# EasyEDA schematic SCH_Sensor Universal PCB w XOR_2023-07-05.json
TITLE: Sheet_1; REV: 1.0; Date: 2022-06-12; Sheet: 1/1; Drawn By: Edward Niedziejko; Company: Your Company
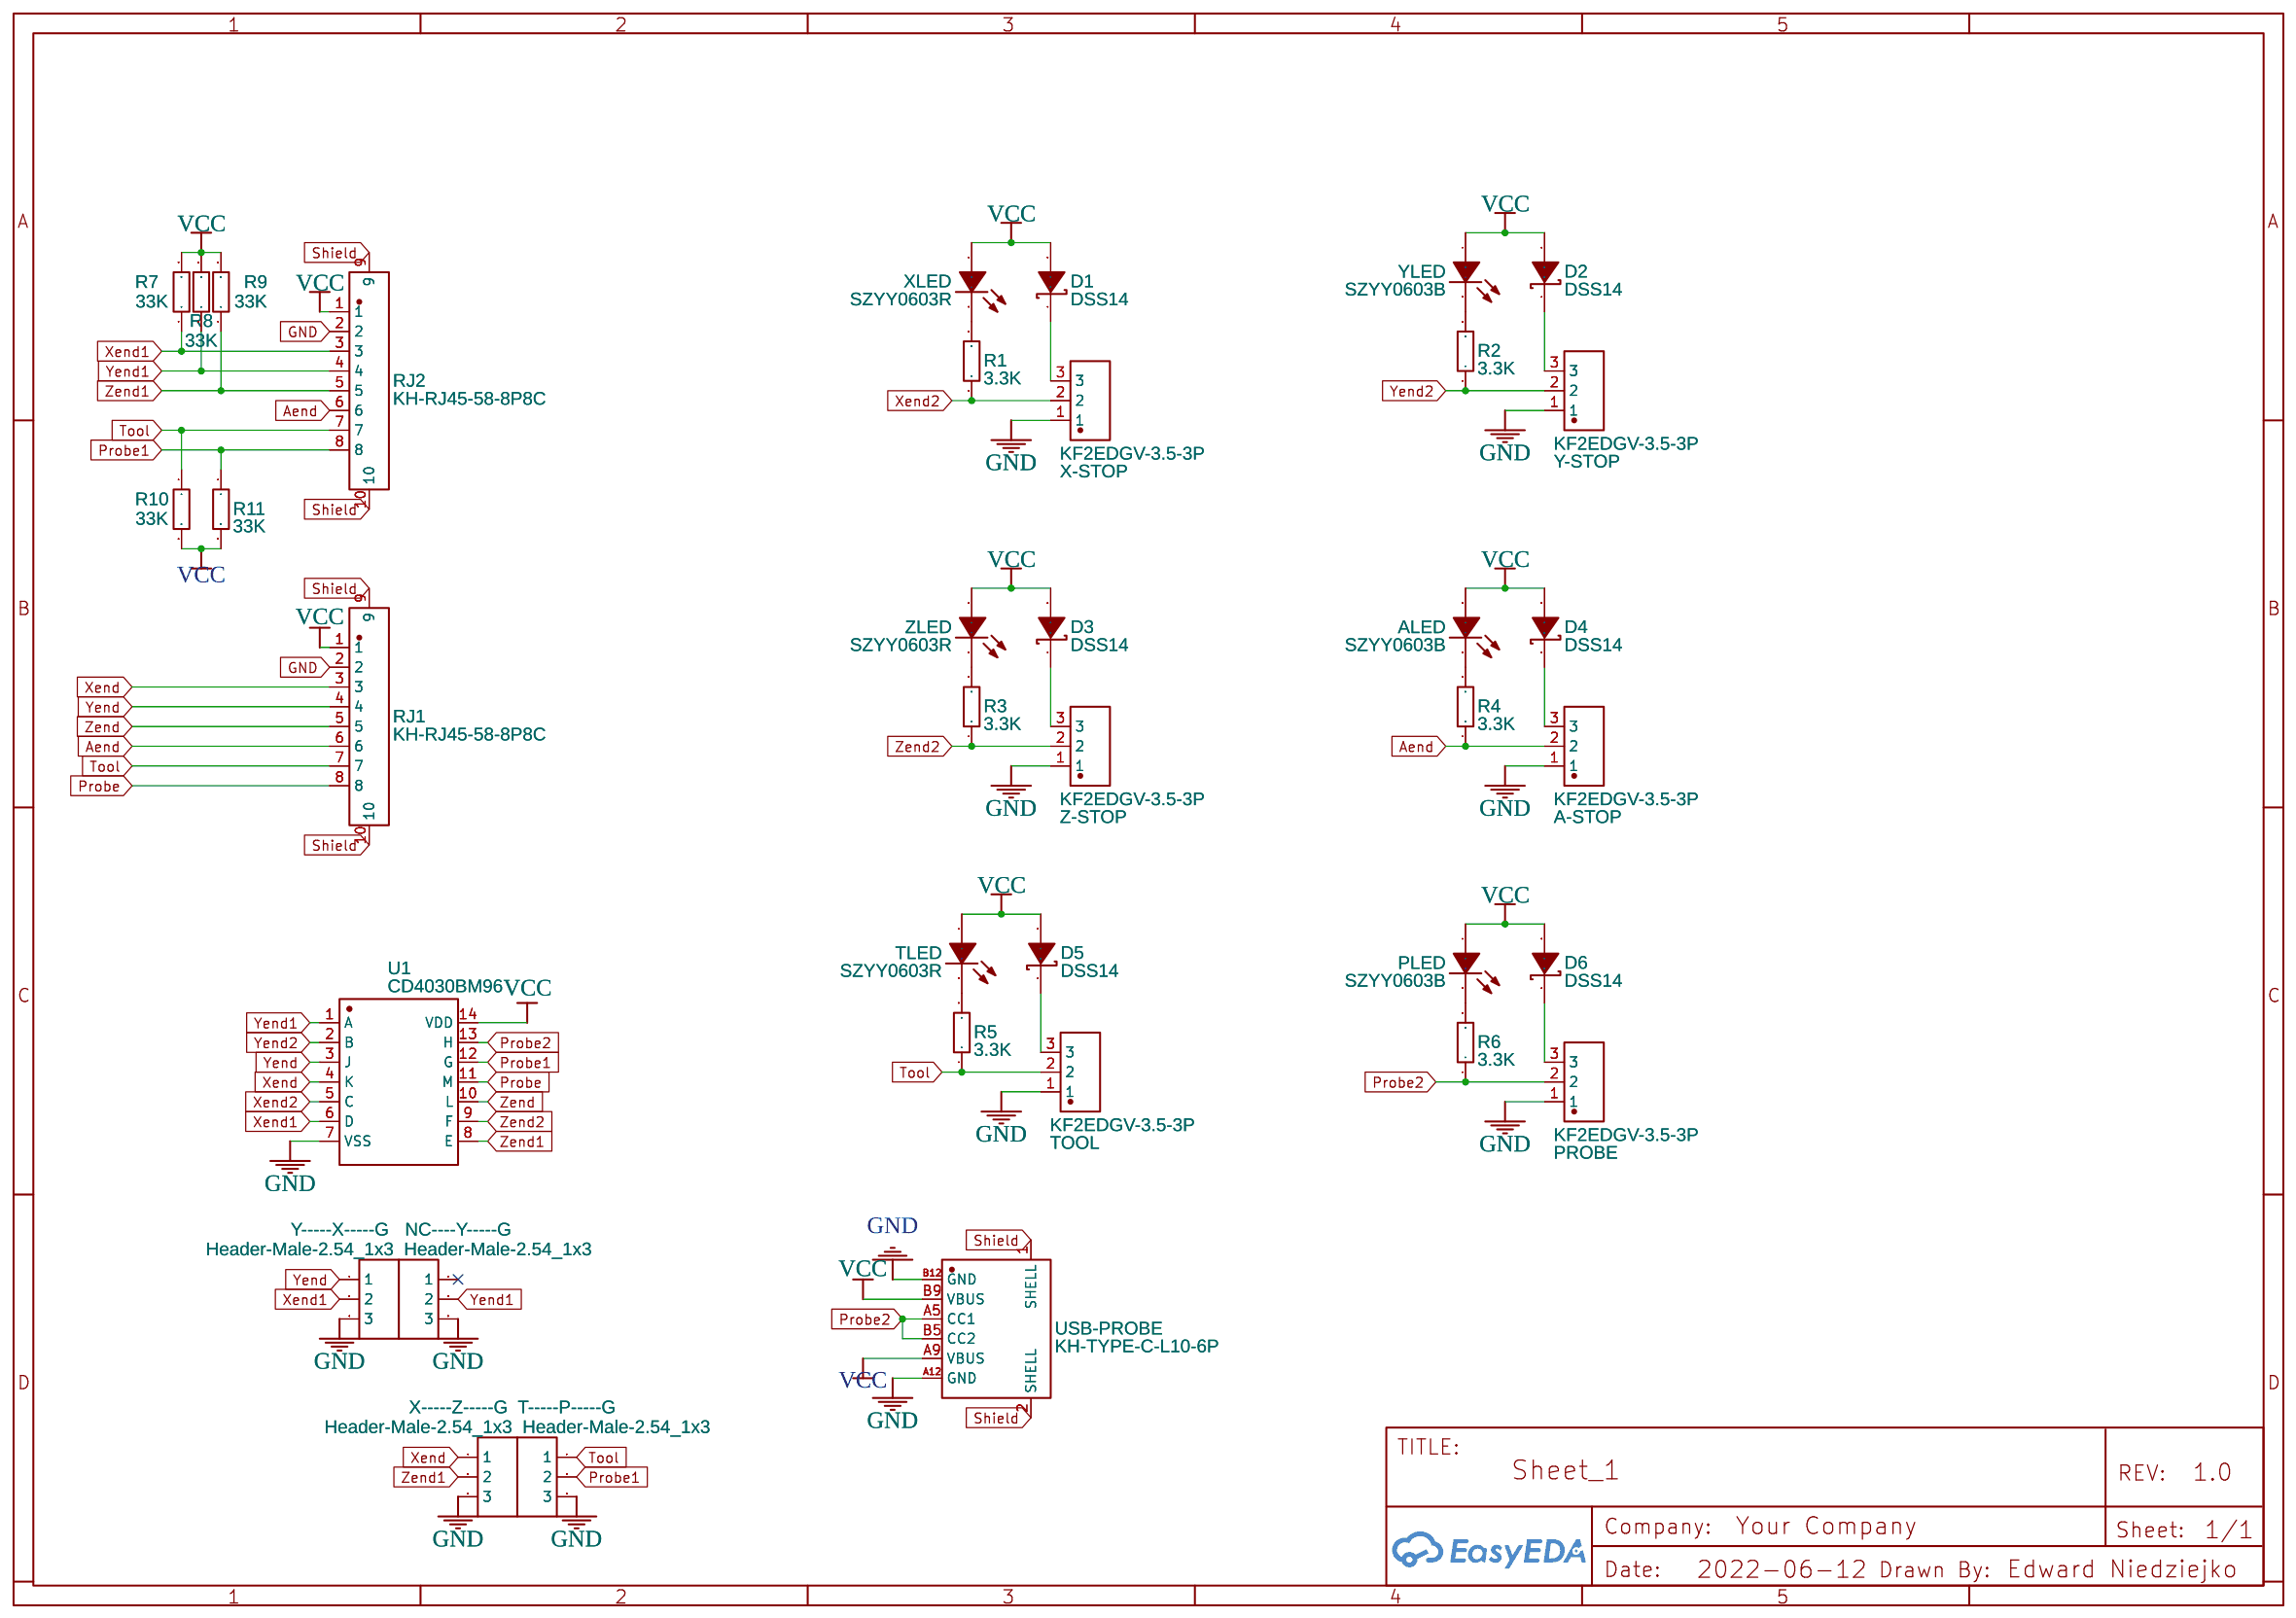
[diagram p0: schematic sheet]

## Parts
A-STOP  KF2EDGV-3.5-3P  [CONN-TH_3P-P3.50_KF2EDGV-3.5-3P]
ALED  SZYY0603B  [LED0603-R-RD_BLUE]
D1  DSS14  [SOD-123_L2.8-W1.8-LS3.7-RD]
D2  DSS14  [SOD-123_L2.8-W1.8-LS3.7-RD]
D3  DSS14  [SOD-123_L2.8-W1.8-LS3.7-RD]
D4  DSS14  [SOD-123_L2.8-W1.8-LS3.7-RD]
D5  DSS14  [SOD-123_L2.8-W1.8-LS3.7-RD]
D6  DSS14  [SOD-123_L2.8-W1.8-LS3.7-RD]
NC----Y-----G  Header-Male-2.54_1x3  [HDR-TH_3P-P2.54-V-M-1]
PLED  SZYY0603B  [LED0603-R-RD_BLUE]
PROBE  KF2EDGV-3.5-3P  [CONN-TH_3P-P3.50_KF2EDGV-3.5-3P]
R1  3.3K  [R0805]
R2  3.3K  [R0805]
R3  3.3K  [R0805]
R4  3.3K  [R0805]
R5  3.3K  [R0805]
R6  3.3K  [R0805]
R7  33K  [R0805]
R8  33K  [R0805]
R9  33K  [R0805]
R10  33K  [R0805]
R11  33K  [R0805]
RJ1  KH-RJ45-58-8P8C  [RJ45-TH_KH-RJ45-58-8P8C]
RJ2  KH-RJ45-58-8P8C  [RJ45-TH_KH-RJ45-58-8P8C]
T-----P-----G  Header-Male-2.54_1x3  [HDR-TH_3P-P2.54-V-M-1]
TLED  SZYY0603R  [LED0603-R-RD]
TOOL  KF2EDGV-3.5-3P  [CONN-TH_3P-P3.50_KF2EDGV-3.5-3P]
U1  CD4030BM96  [SOIC-14_L8.7-W3.9-P1.27-LS6.0-BL]
USB-PROBE  KH-TYPE-C-L10-6P  [USB-C-TH_KH-TYPE-C-L10-6P]
X-----Z-----G  Header-Male-2.54_1x3  [HDR-TH_3P-P2.54-V-M-1]
X-STOP  KF2EDGV-3.5-3P  [CONN-TH_3P-P3.50_KF2EDGV-3.5-3P]
XLED  SZYY0603R  [LED0603-R-RD]
Y-----X-----G  Header-Male-2.54_1x3  [HDR-TH_3P-P2.54-V-M-1]
Y-STOP  KF2EDGV-3.5-3P  [CONN-TH_3P-P3.50_KF2EDGV-3.5-3P]
YLED  SZYY0603B  [LED0603-R-RD_BLUE]
Z-STOP  KF2EDGV-3.5-3P  [CONN-TH_3P-P3.50_KF2EDGV-3.5-3P]
ZLED  SZYY0603R  [LED0603-R-RD]

## Library data of the parts
A-STOP PROBE TOOL X-STOP Y-STOP Z-STOP = KF2EDGV-3.5-3P: Supplier: LCSC; Supplier Part: C441322; Manufacturer: Cixi Kefa Elec; Contributor: LCSC; JLCPCB Part Class: Extended Part
ALED PLED YLED = SZYY0603B: Supplier: LCSC; Supplier Part: C434421; Manufacturer: yongyu(永裕光电); Contributor: LCSC; JLCPCB Part Class: Extended Part
D1-D6 = DSS14: Supplier: LCSC; Manufacturer: 星海; Supplier Part: C59293; JLCPCB Part Class: Extended Part
NC----Y-----G T-----P-----G X-----Z-----G Y-----X-----G = Header-Male-2.54_1x3: Supplier: LCSC; Manufacturer: BOOMELE(博穆精密); Manufacturer Part: 2.54-1*3P针; Supplier Part: C49257; JLCPCB Part Class: Extended Part
R1-R6 = RC0805FR-073K3L: Supplier: LCSC; Manufacturer: YAGEO(国巨); Supplier Part: C114531; JLCPCB Part Class: Extended Part; Resistance: 3.3kΩ
R7-R11 = RC0805JR-0733KL: Supplier: LCSC; Manufacturer: YAGEO(国巨); Supplier Part: C137446; JLCPCB Part Class: Extended Part; Resistance: 33kΩ
RJ1 RJ2 = KH-RJ45-58-8P8C: Supplier: LCSC; Supplier Part: C2683360; Manufacturer: kinghelm(金航标); JLCPCB Part Class: Extended Part; Contributor: LCSC
TLED XLED ZLED = SZYY0603R: Supplier: LCSC; Supplier Part: C434419; Manufacturer: yongyu(永裕光电); Contributor: LCSC; JLCPCB Part Class: Extended Part
U1 = CD4030BM96: Supplier: LCSC; Manufacturer: TI(德州仪器); Supplier Part: C44237; JLCPCB Part Class: Extended Part
USB-PROBE = KH-TYPE-C-L10-6P: Supplier: LCSC; Supplier Part: C2688788; Manufacturer: kinghelm(金航标); Contributor: LCSC; JLCPCB Part Class: Extended Part

## Nets
GND: A-STOP.1 NC----Y-----G.3 PROBE.1 RJ1.2 RJ2.2 T-----P-----G.3 TOOL.1 U1.7(VSS) USB-PROBE.A12(GND) USB-PROBE.B12(GND) X-----Z-----G.3 X-STOP.1 Y-----X-----G.3 Y-STOP.1 Z-STOP.1
VCC: ALED.1(+) D1.2(A) D2.2(A) D3.2(A) D4.2(A) D5.2(A) D6.2(A) PLED.1(+) R7.2 R8.2 R9.2 R10.2 R11.2 RJ1.1 RJ2.1 TLED.1(+) U1.14(VDD) USB-PROBE.A9(VBUS) USB-PROBE.B9(VBUS) XLED.1(+) YLED.1(+) ZLED.1(+)
Aend: A-STOP.2 R4.1 RJ1.6 RJ2.6
Probe: RJ1.8 U1.11(M)
Probe1: R11.1 RJ2.8 T-----P-----G.2 U1.12(G)
Probe2: PROBE.2 R6.1 U1.13(H) USB-PROBE.A5(CC1) USB-PROBE.B5(CC2)
Shield: RJ1.9 RJ1.10 RJ2.9 RJ2.10 USB-PROBE.1(SHELL) USB-PROBE.2(SHELL)
Tool: R5.1 R10.1 RJ1.7 RJ2.7 T-----P-----G.1 TOOL.2
Xend: RJ1.3 U1.4(K) X-----Z-----G.1
Xend1: R7.1 RJ2.3 U1.6(D) Y-----X-----G.2
Xend2: R1.1 U1.5(C) X-STOP.2
Yend: RJ1.4 U1.3(J) Y-----X-----G.1
Yend1: NC----Y-----G.2 R8.1 RJ2.4 U1.1(A)
Yend2: R2.1 U1.2(B) Y-STOP.2
Zend: RJ1.5 U1.10(L)
Zend1: R9.1 RJ2.5 U1.8(E) X-----Z-----G.2
Zend2: R3.1 U1.9(F) Z-STOP.2
Net-(A-STOP-3): A-STOP.3 D4.1(K)
Net-(ALED-2): ALED.2(-) R4.2
Net-(D1-1): D1.1(K) X-STOP.3
Net-(D2-1): D2.1(K) Y-STOP.3
Net-(D3-1): D3.1(K) Z-STOP.3
Net-(D5-1): D5.1(K) TOOL.3
Net-(D6-1): D6.1(K) PROBE.3
Net-(PLED-2): PLED.2(-) R6.2
Net-(R1-2): R1.2 XLED.2(-)
Net-(R2-2): R2.2 YLED.2(-)
Net-(R3-2): R3.2 ZLED.2(-)
Net-(R5-2): R5.2 TLED.2(-)

Not connected (* = marked no-connect by the designer): NC----Y-----G 1*
